# EAGLE design PogoPins_FTDI (EAGLE 8.3.2)
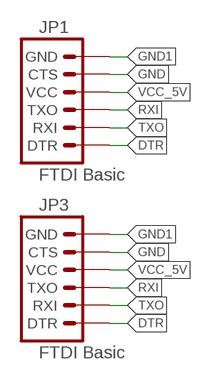
[diagram p0: schematic, sheet 1]

## Parts
JP1  FTDI Basic  ARDUINO_SERIAL_PROGRAMPTH  [1X06]
JP3  FTDI Basic  ARDUINO_SERIAL_PROGRAMPTH  [1X06]

## Nets
DTR: JP1.1(DTR) JP3.1(DTR)
GND: JP1.5(CTS) JP3.5(CTS)
GND1: JP1.6(GND) JP3.6(GND)
RXI: JP1.3(TXO) JP3.3(TXO)
TXO: JP1.2(RXI) JP3.2(RXI)
VCC_5V: JP1.4(VCC) JP3.4(VCC)

## Library data of the parts
JP1 JP3 = SparkFun:ARDUINO_SERIAL_PROGRAM

## Net classes
0 default: width 0.203 mm

## Board
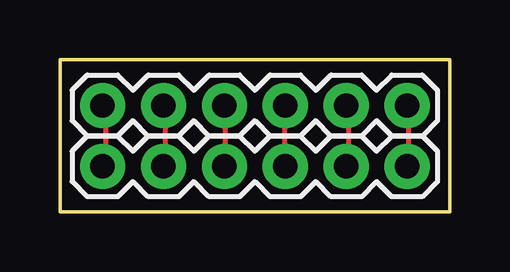
[diagram p1: board, top side]

Size 16.26 x 6.35 mm. Coordinates in mm from the lower left corner, seen from the top.
Outline: 0,0 0,6.35 16.26,6.35 16.26,0 0,0
Copper layers (1*16): Top 0.035mm / dielectric 1.5mm / Bottom 0.035mm
Design rules "default": minimum track width 6mil, minimum drill 0.35mm, track to track 6mil, track to pad 6mil, pad to pad 6mil, via to via 6mil, smd to smd 6mil, copper to edge 40mil, drill to drill 6mil, minimum pad ring 10mil, minimum via ring 8mil, stop-mask expansion 4mil, vias tented up to drill 0mil, thermal gap 10mil

### Footprints (pad centres in the part's own frame; a part is rotated, then mirrored left to right if it is on the bottom)
1X06 = drill 1.016 pad 1.88: 1 0,0; 2 2.54,0; 3 5.08,0; 4 7.62,0; 5 10.16,0; 6 12.7,0

### Placement (x,y rotation side)
JP1  1.78,1.91 0 top
JP3  1.78,4.45 0 top

### Tracks (layer width: path | path; a pad name or v marks a point on that pad's centre or on a via)
DTR
  Top 0.203: JP1.1 1.9,2.03 1.9,4.34 JP3.1
GND
  Top 0.203: JP1.5 12.04,2.03 12.04,4.34 JP3.5
GND1
  Top 0.203: JP1.6 14.53,2.03 14.53,4.34 JP3.6
RXI
  Top 0.203: JP1.3 6.88,2.03 6.88,4.34 JP3.3
TXO
  Top 0.203: JP1.2 4.39,2.03 4.39,4.34 JP3.2
VCC_5V
  Top 0.203: JP1.4 9.37,2.03 9.37,4.34 JP3.4